# EAGLE design Nokia5110_BusCard (EAGLE 6.5.0)
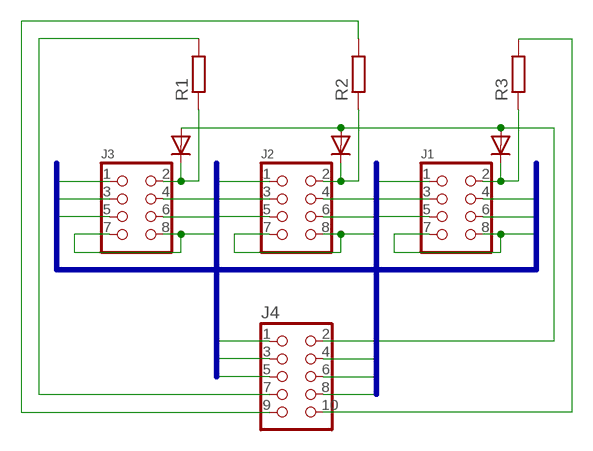
[diagram p0: schematic, sheet 1]

## Parts
D1  1N4148DO35-7  [DO35-7]
D2  1N4148DO35-7  [DO35-7]
D3  1N4148DO35-7  [DO35-7]
J1  CON_HEADER_2X04-SHRD_PTH  [PINSHRD_PTH_2X04]
J2  CON_HEADER_2X04-SHRD_PTH  [PINSHRD_PTH_2X04]
J3  CON_HEADER_2X04-SHRD_PTH  [PINSHRD_PTH_2X04]
J4  CON_HEADER_2X05-PTH+SHROUDED_A  [PINSHRD_PTH_2X05]
R1  R-EU_0207/10  [0207/10]
R2  R-EU_0207/10  [0207/10]
R3  R-EU_0207/10  [0207/10]

## Nets
N$1: D3.C J3.2 R1.1
N$2: D2.C J2.2 R2.1
N$3: D1.C J1.2 R3.1
N$4: D1.A D2.A D3.A J4.2
N$8: J4.7 R1.2
N$9: J4.9 R2.2
N$10: J4.10 R3.2
NOKIABUS1: J1.1 J2.1 J3.1 J4.1
NOKIABUS3: J1.3 J2.3 J3.3 J4.3
NOKIABUS4: J1.4 J2.4 J3.4 J4.4
NOKIABUS5: J1.5 J2.5 J3.5 J4.5
NOKIABUS6: J1.6 J2.6 J3.6 J4.6
NOKIABUS8: J1.7 J1.8 J2.7 J2.8 J3.7 J3.8 J4.8

## Buses
NOKIABUS[1..8]

## Library data of the parts
D1-D3 = diode:1N4148: DIODE high speed (Philips)
J1-J3 = dp_devices:CON_HEADER_2X04
J4 = dp_devices:CON_HEADER_2X05: 2x05 pin header
R1-R3 = rcl:R-EU_: RESISTOR, European symbol

## Board
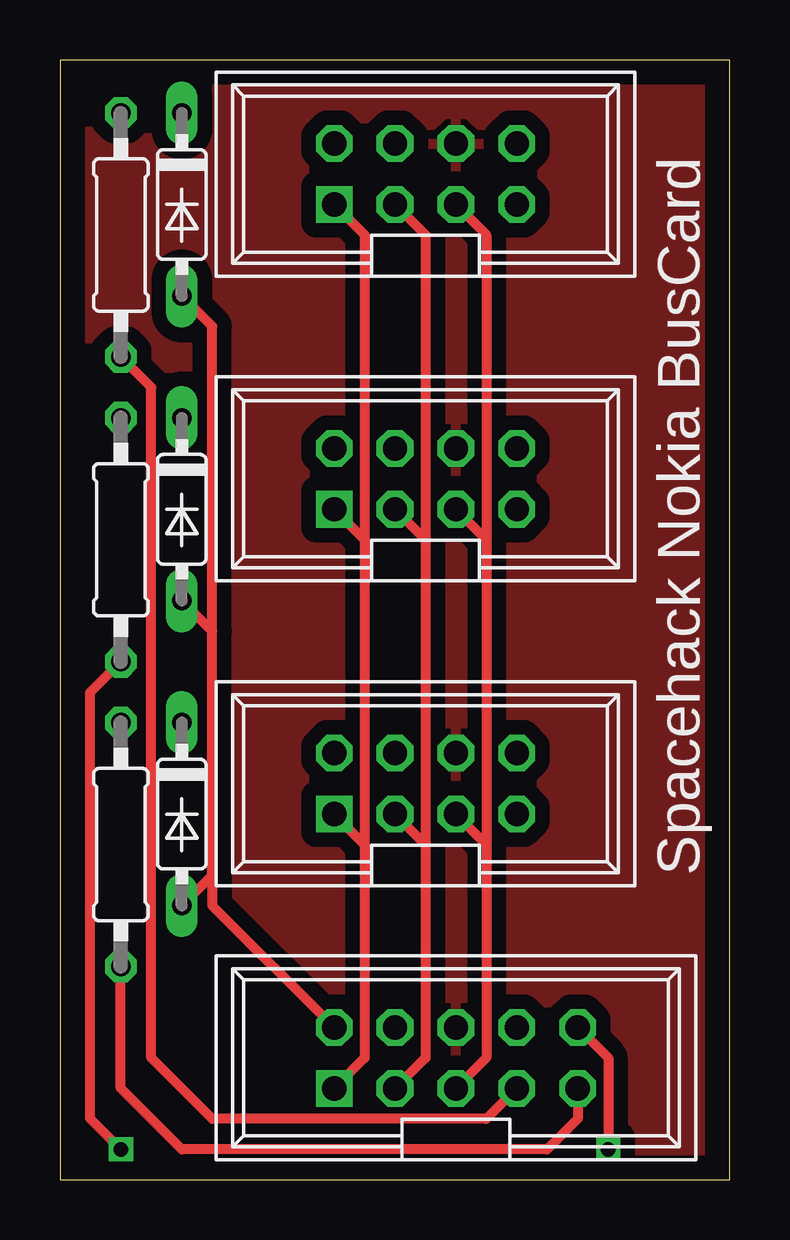
[diagram p1: board, top side]
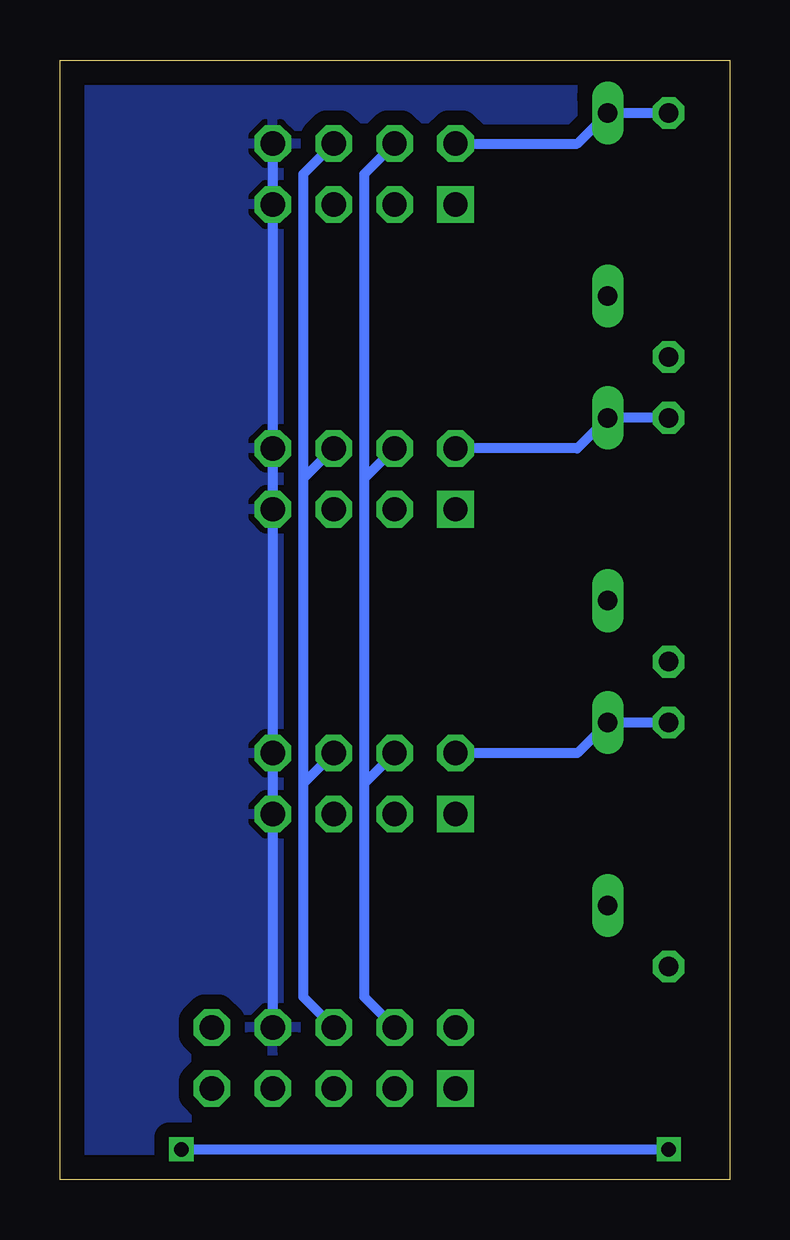
[diagram p2: board, bottom side, seen from below]

Size 27.92 x 46.66 mm. Coordinates in mm from the lower left corner, seen from the top.
Outline: 0,0 27.92,0 27.92,46.66 0,46.66 0,0
Copper layers (1*16): Top 0.035mm / dielectric 1.5mm / Bottom 0.035mm
Design rules "default": minimum track width 10mil, minimum drill 24mil, track to track 8mil, track to pad 8mil, pad to pad 8mil, via to via 8mil, smd to smd 8mil, copper to edge 40mil, drill to drill 8mil, minimum pad ring 10mil, minimum via ring 8mil, stop-mask expansion 4mil, vias tented up to drill 0mil, thermal gap 10mil

### Footprints (pad centres in the part's own frame; a part is rotated, then mirrored left to right if it is on the bottom)
DO35-7 = drill 0.813 long: A 3.81,0; C -3.81,0
PINSHRD_PTH_2X04 = drill 1.016 square: 1 -3.81,-1.27 | drill 1.016 octagon: 2 -3.81,1.27; 3 -1.27,-1.27; 4 -1.27,1.27; 5 1.27,-1.27; 6 1.27,1.27; 7 3.81,-1.27; 8 3.81,1.27
PINSHRD_PTH_2X05 = drill 1.016 square: 1 -5.08,-1.27 | drill 1.016 octagon: 2 -5.08,1.27; 3 -2.54,-1.27; 4 -2.54,1.27; 5 0,-1.27; 6 0,1.27; 7 2.54,-1.27; 8 2.54,1.27; 9 5.08,-1.27; 10 5.08,1.27
0207/10 = drill 0.813 octagon: 1 -5.08,0; 2 5.08,0

### Placement (x,y rotation side)
D1  5.08,27.94 270 top
D2  5.08,15.24 270 top
D3  5.08,40.64 270 top
J1  15.24,29.21 0 top
J2  15.24,16.51 0 top
J3  15.24,41.91 0 top
J4  16.51,5.08 0 top
R1  2.54,39.37 270 top
R2  2.54,13.97 270 top
R3  2.54,26.67 270 top

### Tracks (layer width: path | path; a pad name or v marks a point on that pad's centre or on a via)
N$1
  Bottom 0.406: J3.2 6.35,43.18 D3.C R1.1
N$2
  Bottom 0.406: R2.1 D2.C 6.35,17.78 J2.2
N$3
  Bottom 0.406: R3.1 D1.C 6.35,30.48 J1.2
N$4
  Top 0.406: D2.A 6.35,12.7 | 6.35,12.7 6.35,22.86 | 6.35,22.86 6.35,35.56 D3.A | D1.A 6.35,22.86 | 6.35,12.7 6.35,11.43 J4.2
N$8
  Top 0.406: J4.7 17.78,2.54 6.35,2.54 3.81,5.08 3.81,33.02 R1.2
N$9
  Top 0.406: J4.9 21.59,2.54 20.32,1.27 5.08,1.27 2.54,3.81 R2.2
N$10  (via drill 0.6)
  Top 0.406: J4.10 22.86,5.08 v22.86,1.27 | v2.54,1.27 1.27,2.54 1.27,20.32 R3.2
  Bottom 0.406: v22.86,1.27 v2.54,1.27
NOKIABUS1
  Top 0.406: J3.1 12.7,39.37 12.7,26.67 | 12.7,26.67 12.7,13.97 | 12.7,13.97 12.7,5.08 J4.1 | J2.1 12.7,13.97 | J1.1 12.7,26.67
NOKIABUS3
  Top 0.406: J3.3 15.24,39.37 15.24,26.67 | 15.24,26.67 15.24,13.97 | 15.24,13.97 15.24,5.08 J4.3 | J1.3 15.24,26.67 | J2.3 15.24,13.97
NOKIABUS4
  Bottom 0.406: J3.4 15.24,41.91 15.24,29.21 | 15.24,29.21 15.24,16.51 | 15.24,16.51 15.24,7.62 J4.4 | J1.4 15.24,29.21 | J2.4 15.24,16.51
NOKIABUS5
  Top 0.406: J3.5 17.78,39.37 17.78,26.67 | 17.78,26.67 17.78,13.97 | 17.78,13.97 17.78,5.08 J4.5 | J2.5 17.78,13.97 | J1.5 17.78,26.67
NOKIABUS6
  Bottom 0.406: J3.6 17.78,41.91 17.78,29.21 | 17.78,29.21 17.78,16.51 | 17.78,16.51 17.78,7.62 J4.6 | J2.6 17.78,16.51 | J1.6 17.78,29.21
  pour Top (isolate 0.61): 0,0 27.94,0 27.94,46.99 0,46.99
NOKIABUS8
  Bottom 0.406: J3.8 J3.7 J1.8 J1.7 J2.8 J2.7 J4.8
  pour Bottom (isolate 0.61): 0,0 27.94,0 27.94,46.99 0,46.99

### Text on the board
tNames: Spacehack Nokia BusCard